# Altium project Project_HUMA-mini.PrjPcb
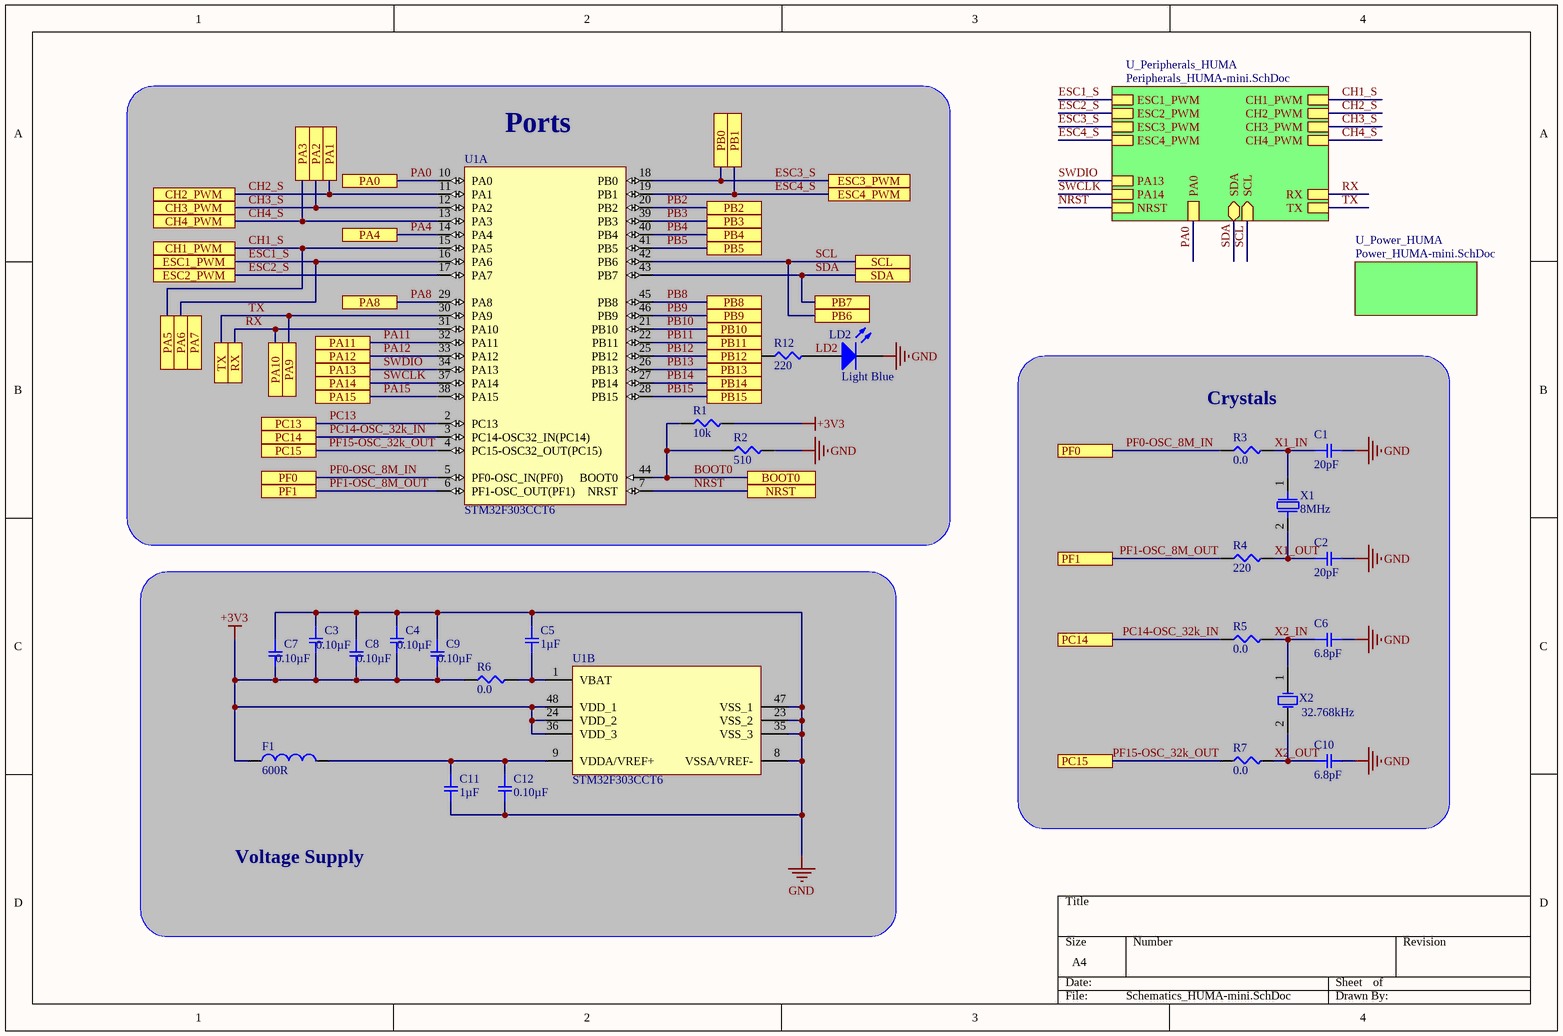
[diagram p0: Schematics_HUMA-mini.SchDoc]
3 sheets, 54 parts. Net scope: hierarchical (ports join the sheet entries above them; power ports are global).
Board file: PCB_HUMA-mini.PcbDoc
Sheets:
  Schematics_HUMA-mini.SchDoc
    U_Peripherals_HUMA = Peripherals_HUMA-mini.SchDoc
    U_Power_HUMA = Power_HUMA-mini.SchDoc

## Sheet Schematics_HUMA-mini.SchDoc
size A4

### Parts
C1  20pF  [SMD-0805C]
C2  20pF  [SMD-0805C]
C3  0.10µF  [SMD-0805C]
C4  0.10µF  [SMD-0805C]
C5  1µF  [SMD-0805C]
C6  6.8pF  [SMD-0805C]
C7  0.10µF  [SMD-0805C]
C8  0.10µF  [SMD-0805C]
C9  0.10µF  [SMD-0805C]
C10  6.8pF  [SMD-0805C]
C11  1µF  [SMD-0805C]
C12  0.10µF  [SMD-0805C]
F1  Deger: 600R  [IND_0805]  (hidden comment: FERRITE BEAD 600 OHM 1206 1LN)
LD2  Light Blue  [Type 3mm]
R1  10k  [SMD-0805-RES]
R2  510  [SMD-0805-RES]
R3  0.0  [SMD-0805-RES]
R4  220  [SMD-0805-RES]
R5  0.0  [SMD-0805-RES]
R6  0.0  [SMD-0805-RES]
R7  0.0  [SMD-0805-RES]
R12  220  [SMD-0805-RES]
U1  STM32F303CCT6  [STM-LQFP48_N]  (parts A,B of 2)
X1  8MHz  [OSC488W43P488L465H350Q2P]
X2  value 32.768kHz  [R38]  (hidden comment: XTAL)

### Blocks framed on the sheet
Ports: LD2 R1 R2 R12 U1
Crystals: C1 C2 C6 C10 R3-R5 R7 X1 X2
Voltage Supply: C3-C5 C7-C9 C11 C12 F1 R6 U1

### Sub-sheets
U_Peripherals_HUMA = Peripherals_HUMA-mini.SchDoc: ESC1_PWM, ESC2_PWM, ESC3_PWM, ESC4_PWM, SCL (in), SDA (bidir), PA13, PA14, NRST, CH4_PWM, RX, CH3_PWM, CH2_PWM, CH1_PWM, TX, PA0
U_Power_HUMA = Power_HUMA-mini.SchDoc: no entries

### Ports
BOOT0, CH1_PWM, CH2_PWM, CH3_PWM, CH4_PWM, ESC1_PWM, ESC2_PWM, ESC3_PWM, ESC4_PWM, NRST, PA0, PA1, PA2, PA3, PA4, PA5, PA6, PA7, PA8, PA9, PA10, PA11, PA12, PA13, PA14, PA15, PB0, PB1, PB2, PB3, PB4, PB5, PB6, PB7, PB8, PB9, PB10, PB11, PB12, PB13, PB14, PB15, PC13, PC14, PC15, PF0, PF1, RX, SCL, SDA, TX

### Nets
+3V3: C3.2 C4.2 C7.2 C8.2 C9.2 F1.1 R1.2 R6.1 U1.24(VDD_2) U1.36(VDD_3) U1.48(VDD_1)
GND: C1.2 C2.2 C3.1 C4.1 C5.1 C6.2 C7.1 C8.1 C9.1 C10.2 C11.2 C12.2 LD2.1(K) R2.2 U1.8(VSSA/VREF-) U1.23(VSS_2) U1.35(VSS_3) U1.47(VSS_1)
BOOT0: R1.1 R2.1 U1.44(BOOT0) ; port BOOT0
CH1_S: U1.15(PA5) ; port PA5, port CH1_PWM, sheet U_Peripherals_HUMA/CH1_PWM
CH2_S: U1.11(PA1) ; port PA1, port CH2_PWM, sheet U_Peripherals_HUMA/CH2_PWM
CH3_S: U1.12(PA2) ; port PA2, port CH3_PWM, sheet U_Peripherals_HUMA/CH3_PWM
CH4_S: U1.13(PA3) ; port PA3, port CH4_PWM, sheet U_Peripherals_HUMA/CH4_PWM
ESC1_S: U1.16(PA6) ; port PA6, port ESC1_PWM, sheet U_Peripherals_HUMA/ESC1_PWM
ESC2_S: U1.17(PA7) ; port ESC2_PWM, sheet U_Peripherals_HUMA/ESC2_PWM
ESC3_S: U1.18(PB0) ; port PB0, port ESC3_PWM, sheet U_Peripherals_HUMA/ESC3_PWM
ESC4_S: U1.19(PB1) ; port PB1, port ESC4_PWM, sheet U_Peripherals_HUMA/ESC4_PWM
LD2: LD2.2(A) R12.2
NRST: U1.7(NRST) ; port NRST, sheet U_Peripherals_HUMA/NRST
PA0: U1.10(PA0) ; port PA0, sheet U_Peripherals_HUMA/PA0
PA4: U1.14(PA4) ; port PA4
PA8: U1.29(PA8) ; port PA8
PA11: U1.32(PA11) ; port PA11
PA12: U1.33(PA12) ; port PA12
PA15: U1.38(PA15) ; port PA15
PB2: U1.20(PB2) ; port PB2
PB3: U1.39(PB3) ; port PB3
PB4: U1.40(PB4) ; port PB4
PB5: U1.41(PB5) ; port PB5
PB8: U1.45(PB8) ; port PB8
PB9: U1.46(PB9) ; port PB9
PB10: U1.21(PB10) ; port PB10
PB11: U1.22(PB11) ; port PB11
PB12: R12.1 U1.25(PB12) ; port PB12
PB13: U1.26(PB13) ; port PB13
PB14: U1.27(PB14) ; port PB14
PB15: U1.28(PB15) ; port PB15
PC13: U1.2(PC13) ; port PC13
PC14-OSC_32k_IN: R5.1 U1.3(PC14-OSC32_IN(PC14)) ; port PC14
PF0-OSC_8M_IN: R3.1 U1.5(PF0-OSC_IN(PF0)) ; port PF0
PF1-OSC_8M_OUT: R4.1 U1.6(PF1-OSC_OUT(PF1)) ; port PF1
PF15-OSC_32k_OUT: R7.1 U1.4(PC15-OSC32_OUT(PC15)) ; port PC15
RX: U1.31(PA10) ; port PA10, port RX, sheet U_Peripherals_HUMA/RX
SCL: U1.42(PB6) ; port PB6, port SCL, sheet U_Peripherals_HUMA/SCL
SDA: U1.43(PB7) ; port PB7, port SDA, sheet U_Peripherals_HUMA/SDA
SWCLK: U1.37(PA14) ; port PA14, sheet U_Peripherals_HUMA/PA14
SWDIO: U1.34(PA13) ; port PA13, sheet U_Peripherals_HUMA/PA13
TX: U1.30(PA9) ; port PA9, port TX, sheet U_Peripherals_HUMA/TX
X1_IN: C1.1 R3.2 X1.1
X1_OUT: C2.1 R4.2 X1.2
X2_IN: C6.1 R5.2 X2.1(OSC1)
X2_OUT: C10.1 R7.2 X2.2(OSC2)
NetC5_2: C5.2 R6.2 U1.1(VBAT)
NetC11_1: C11.1 C12.1 F1.2 U1.9(VDDA/VREF+)

### Library data of the parts
C1 C2 = GQM2195C1H200JB01D: CAP CER 20PF 50V NP0 0805; Manufacturer: Murata Electronics North America; Factory Stock: 0; Unit Price (USD): 0.78; Minimum Quantity: 1; Tolerance: ±5%; Temperature Coefficient: C0G, NP0; Datasheets: http://www.murata.com/~/media/webrenewal/support/library/catalog/products/capacitor/mlcc/c02e.pdf; Image: //media.digikey.com/Renders/Murata%20Renders/0805(GxM9).jpg; Digi-Key Part Number: 490-3607-1-ND; Part Number: GQM2195C1H200JB01D; Quantity Available: 270; @ qty: 0; Packaging: Cut Tape (CT); Series: GQM; Part Status: Active; Value: 20pF; Voltage: 50V; Operating Temperature: -55°C ~ 125°C; Features: High Q, Low Loss; Ratings: -; Applications: RF, Microwave, High Frequency; Mounting Type: Surface Mount, MLCC; Package / Case: 0805 (2012 Metric); Size / Dimension: 0.079" L x 0.049" W (2.00mm x 1.25mm); Height - Seated (Max): -; Thickness (Max): 0.037" (0.95mm); Lead Spacing: -; Lead Style: -
C3 C4 C7-C9 C12 = GRM219R71E104KA01D: CAP CER 0.1UF 25V X7R 0805; Manufacturer: Murata Electronics North America; Factory Stock: 0; Unit Price (USD): 0.12; Minimum Quantity: 1; Tolerance: ±10%; Datasheets: http://www.murata.com/~/media/webrenewal/support/library/catalog/products/capacitor/mlcc/c02e.pdf; Image: //media.digikey.com/Renders/Murata%20Renders/0805%20(2012%20Metric)%20.85mm.jpg; Digi-Key Part Number: 490-12754-1-ND; Part Number: GRM219R71E104KA01D; Quantity Available: 8594; @ qty: 0; Packaging: Cut Tape (CT); Series: GRM; Part Status: Active; Value: 0.10µF; Voltage: 25V; Temperature Coefficient: X7R; Operating Temperature: -55°C ~ 125°C; Features: -; Ratings: -; Applications: General Purpose; Mounting Type: Surface Mount, MLCC; Package / Case: 0805 (2012 Metric); Size / Dimension: 0.079" L x 0.049" W (2.00mm x 1.25mm); Height - Seated (Max): -; Thickness (Max): 0.037" (0.95mm); Lead Spacing: -; Lead Style: -
C5 C11 = GRT21BR61E105KE13L: CAP CER 1UF 25V X5R 0805; Manufacturer: Murata Electronics North America; Factory Stock: 0; Unit Price (USD): 0.2; Minimum Quantity: 1; Tolerance: ±10%; Datasheets: http://search.murata.co.jp/Ceramy/image/img/A01X/G101/ENG/GRT21BR61E105KE13-01.pdf; Image: //media.digikey.com/Renders/Murata%20Renders/GRT%20Series%200805(2012%20Metric).jpg; Digi-Key Part Number: 490-12386-1-ND; Part Number: GRT21BR61E105KE13L; Quantity Available: 2725; @ qty: 0; Packaging: Cut Tape (CT); Series: GRT; Part Status: Active; Value: 1µF; Voltage: 25V; Temperature Coefficient: X5R; Operating Temperature: -55°C ~ 85°C; Features: -; Ratings: AEC-Q200; Applications: Automotive; Mounting Type: Surface Mount, MLCC; Package / Case: 0805 (2012 Metric); Size / Dimension: 0.079" L x 0.049" W (2.00mm x 1.25mm); Height - Seated (Max): -; Thickness (Max): 0.057" (1.45mm); Lead Spacing: -; Lead Style: -
C6 C10 = GQM2195C2A6R8DB01D: CAP CER 6.8PF 100V NP0 0805; Manufacturer: Murata Electronics North America; Factory Stock: 0; Unit Price (USD): 0.71; Minimum Quantity: 1; Tolerance: ±0.5pF; Temperature Coefficient: C0G, NP0; Datasheets: http://www.murata.com/~/media/webrenewal/support/library/catalog/products/capacitor/mlcc/c02e.pdf; Image: //media.digikey.com/Renders/Murata%20Renders/0805(GxM9).jpg; Digi-Key Part Number: 490-8142-1-ND; Part Number: GQM2195C2A6R8DB01D; Quantity Available: 3756; @ qty: 0; Packaging: Cut Tape (CT); Series: GQM; Part Status: Active; Value: 6.8pF; Voltage: 100V; Operating Temperature: -55°C ~ 125°C; Features: High Q, Low Loss; Ratings: -; Applications: RF, Microwave, High Frequency; Mounting Type: Surface Mount, MLCC; Package / Case: 0805 (2012 Metric); Size / Dimension: 0.079" L x 0.049" W (2.00mm x 1.25mm); Height - Seated (Max): -; Thickness (Max): 0.037" (0.95mm); Lead Spacing: -; Lead Style: -
F1 = Ferrite 600ohm 1206(742792118): 600 Ohms @ 100MHz 1 Signal Line Ferrite Bead 1206 (3216 Metric) 2.5A 70mOhm; Kılıf: 1206; -Sicaklik: -55; +Sicaklik: +125; Nero Kodu: NE-S-02777; Yıkama Bilgisi: UYGUN; Epoksi Bilgisi: YOK; Lehim Yöntemi: SMD; Cins: Ferrite; Uretici Kodu: 742792118; Kaplama Bilgisi: UYGUN; MSL: 1 (Unlimited)
LD2 = 151033BS03000: THT LED round mono-color waterclear, WL-TMRW , Blue; PackageReference: Type 3mm; Emitting color: Blue; PartNumber: 151033BS03000; ComponentLink1Description: Manufacturer URL; ComponentLink1URL: http://www.we-online.com; ComponentLink2Description: Datasheet; ComponentLink2URL: http://katalog.we-online.de/pbs/datasheet/7448042001.pdfhttp://katalog.we-online.de/pbs/datasheet/7448042001.pdfhttp://katalog.we-online.de/pbs/datasheet/7448042001.pdfhttp://katalog.we-online.de/pbs/datasheet/151033BS03000.pdf
R1 = ERJ-6ENF1002V: RES SMD 10K OHM 1% 1/8W 0805; Manufacturer: Panasonic Electronic Components; Factory Stock: 0; Unit Price (USD): 0.00729; @ qty: 1500; Minimum Quantity: 1; Power (Watts): 0.125W, 1/8W; Temperature Coefficient: ±100ppm/°C; Part Number: ERJ-6ENF1002V; Datasheets: http://industrial.panasonic.com/www-cgi/jvcr13pz.cgi?E+PZ+3+AOA0002+ERJ6ENF1002V+7+WW; Image: //media.digikey.com/Renders/Panasonic%20Renders/ERJ-0805%20Pkg.jpg; Digi-Key Part Number: P10.0KCCT-ND; Quantity Available: 3985614; Packaging: Cut Tape (CT); Series: ERJ; Part Status: Active; Value: 10k; Tolerance: ±1%; Composition: Thick Film; Features: Automotive AEC-Q200; Operating Temperature: -55°C ~ 155°C; Package / Case: 0805 (2012 Metric); Supplier Device Package: 0805; Size / Dimension: 0.079" L x 0.049" W (2.00mm x 1.25mm); Height - Seated (Max): 0.028" (0.70mm); Number of Terminations: 2; Failure Rate: -
R2 = ERJ-P06J511V: RES SMD 510 OHM 5% 1/2W 0805; Manufacturer: Panasonic Electronic Components; Factory Stock: 0; Unit Price (USD): 0.01839; @ qty: 1500; Minimum Quantity: 1; Power (Watts): 0.5W, 1/2W; Temperature Coefficient: ±200ppm/°C; Part Number: ERJ-P06J511V; Datasheets: https://industrial.panasonic.com/cdbs/www-data/pdf/RDA0000/AOA0000C243.pdf; Image: //media.digikey.com/Renders/Panasonic%20Renders/ERJ-0805%20Pkg.jpg; Digi-Key Part Number: P510ADCT-ND; Quantity Available: 54515; Packaging: Cut Tape (CT); Series: ERJ; Part Status: Active; Value: 510; Tolerance: ±5%; Composition: Thick Film; Features: Automotive AEC-Q200, Pulse Withstanding; Operating Temperature: -55°C ~ 155°C; Package / Case: 0805 (2012 Metric); Supplier Device Package: 0805; Size / Dimension: 0.079" L x 0.049" W (2.00mm x 1.25mm); Height - Seated (Max): 0.028" (0.70mm); Number of Terminations: 2; Failure Rate: -
R3 R5-R7 = ERJ-6GEY0R00V: RES SMD 0.0 OHM JUMPER 1/8W 0805; Manufacturer: Panasonic Electronic Components; Factory Stock: 0; Unit Price (USD): 0.00544; @ qty: 1500; Minimum Quantity: 1; Power (Watts): 0.125W, 1/8W; Part Number: ERJ-6GEY0R00V; Datasheets: http://industrial.panasonic.com/www-cgi/jvcr13pz.cgi?E+PZ+3+AOA0001+ERJ6GEY0R00V+7+WW; Image: //media.digikey.com/Renders/Panasonic%20Renders/ERJ-0805%20Pkg.jpg; Digi-Key Part Number: P0.0ACT-ND; Quantity Available: 1597627; Packaging: Cut Tape (CT); Series: ERJ; Part Status: Active; Value: 0.0; Tolerance: Jumper; Composition: Thick Film; Features: Automotive AEC-Q200; Temperature Coefficient: -; Operating Temperature: -55°C ~ 155°C; Package / Case: 0805 (2012 Metric); Supplier Device Package: 0805; Size / Dimension: 0.079" L x 0.049" W (2.00mm x 1.25mm); Height - Seated (Max): 0.028" (0.70mm); Number of Terminations: 2; Failure Rate: -
R4 = ERJ-6ENF2200V: RES SMD 220 OHM 1% 1/8W 0805; Manufacturer: Panasonic Electronic Components; Factory Stock: 0; Unit Price (USD): 0.00729; @ qty: 1500; Minimum Quantity: 1; Power (Watts): 0.125W, 1/8W; Temperature Coefficient: ±100ppm/°C; Part Number: ERJ-6ENF2200V; Datasheets: http://industrial.panasonic.com/www-cgi/jvcr13pz.cgi?E+PZ+3+AOA0002+ERJ6ENF2200V+7+WW; Image: //media.digikey.com/Renders/Panasonic%20Renders/ERJ-0805%20Pkg.jpg; Digi-Key Part Number: P220CCT-ND; Quantity Available: 111570; Packaging: Cut Tape (CT); Series: ERJ; Part Status: Active; Value: 220; Tolerance: ±1%; Composition: Thick Film; Features: Automotive AEC-Q200; Operating Temperature: -55°C ~ 155°C; Package / Case: 0805 (2012 Metric); Supplier Device Package: 0805; Size / Dimension: 0.079" L x 0.049" W (2.00mm x 1.25mm); Height - Seated (Max): 0.028" (0.70mm); Number of Terminations: 2; Failure Rate: -
R12 = ERJ-P6WJ221V: RES SMD 220 OHM 5% 1/2W 0805; Manufacturer: Panasonic Electronic Components; Factory Stock: 0; Unit Price (USD): 0.08237; @ qty: 1500; Minimum Quantity: 1; Power (Watts): 0.5W, 1/2W; Temperature Coefficient: ±200ppm/°C; Part Number: ERJ-P6WJ221V; Datasheets: https://industrial.panasonic.com/cdbs/www-data/pdf/RDA0000/AOA0000C243.pdf; Image: //media.digikey.com/Renders/Panasonic%20Renders/ERJ-0805%20Pkg.jpg; Digi-Key Part Number: P16946CT-ND; Quantity Available: 4990; Packaging: Cut Tape (CT); Series: ERJ; Part Status: Active; Value: 220; Tolerance: ±5%; Composition: Thick Film; Features: Automotive AEC-Q200, Pulse Withstanding; Operating Temperature: -55°C ~ 155°C; Package / Case: 0805 (2012 Metric); Supplier Device Package: 0805; Size / Dimension: 0.079" L x 0.049" W (2.00mm x 1.25mm); Height - Seated (Max): 0.030" (0.75mm); Number of Terminations: 2; Failure Rate: -
U1 = STM32F303CCT6: ARM Cortex-M4 32-bit MCU, 256 KB Flash, 40 KB Internal RAM, 37 I/Os, 48-pin LQFP, -40 to 85 degC, Tray; D/A Converter: 2x12-bit (2 Channel); FLASH Size (Prog) (kB): 256; I/Os (High Current): 37; Internal RAM Size (kB): 40; Operating Frequency(F) (Processor speed) (MHz): 72; Supply Voltage(Vcc) min (V): 2; DatasheetVersion: Rev. 6; PackageVersion: Rev. 6, 06/2013; PackageReference: LQFP48; PackageDescription: 48-Pin Low Profile Quad Flat Package, 7 x 7 mm Body, 0.5 mm Pitch; Supplier 1: Digi-Key; Supplier Part Number 1: 497-13318-ND; Supplier 2: Newark; Supplier Part Number 2: 46W2192; Supplier 3: Newark; Supplier Part Number 3: 66W7286; Supplier 4: Mouser; Supplier Part Number 4: 511-STM32F303CCT6; Core: ARM Cortex-M4; Packing: Tray; Mounting Technology: Surface Mount; PartNumber: STM32F303CCT6; ComponentLink1Description: Manufacturer URL; ComponentLink1URL: http://www.st.com/web/en/home.html; ComponentLink2Description: Datasheet; ComponentLink2URL: http://www.st.com/st-web-ui/static/active/en/resource/technical/document/datasheet/DM00058181.pdf; ComponentLink3Description: Package Specification; ComponentLink3URL: http://www.st.com/st-web-ui/static/active/en/resource/technical/document/datasheet/DM00058181.pdf
X1 = XTAL8MHz: Crystal; Frequency: 8MHz; Frequency; MP: X14M745600L225; MF: AEL Crystals; SnapEDA_Link: https://www.snapeda.com/parts/X14M745600L225/AEL%20Crystals/view-part/380339/?ref=snap; Price: None; Value: *; Availability: Unavailable; Package: None
X2 = XTAL: Crystal Oscillator; Published: 8-Jun-2000; LatestRevisionDate: 17-Jul-2002; LatestRevisionNote: Re-released for DXP Platform.; PackageReference: R38; Publisher: Altium Limited; PackageDescription: Crystal, Thru-Hole; 2 Leads; Body 3.1 x 8.2 mm (Dia.xH)

## Sheet Peripherals_HUMA-mini.SchDoc
size A4
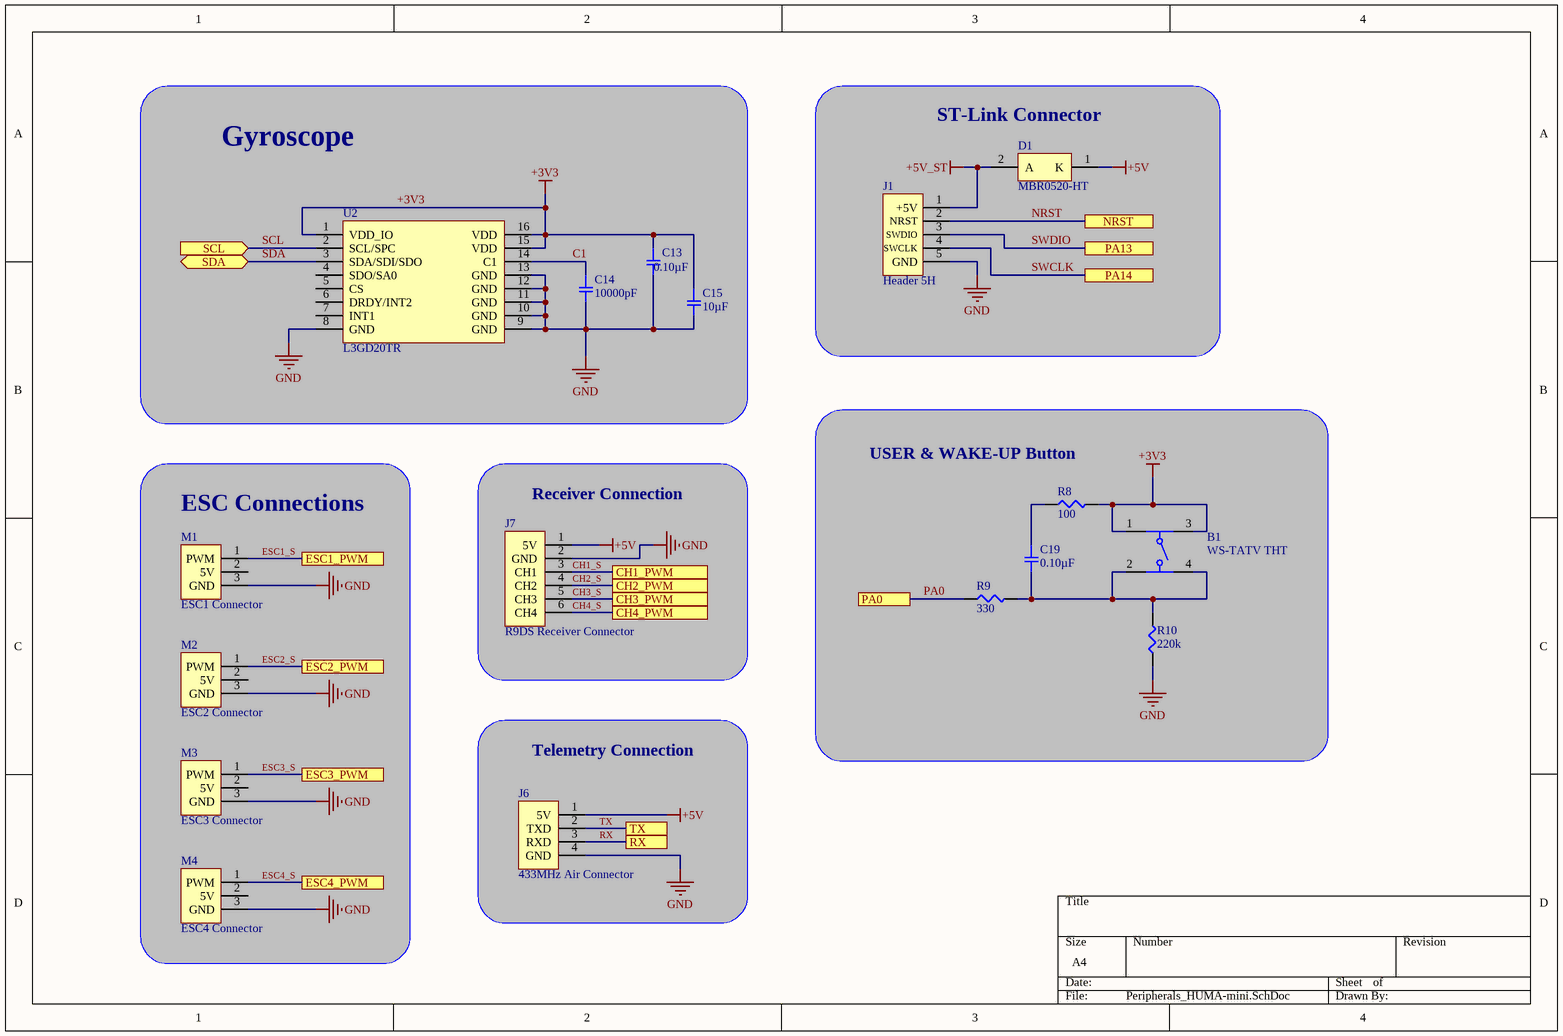
[diagram p1: Peripherals_HUMA-mini.SchDoc]

### Parts
B1  WS-TATV THT  [4301x60507x6]
C13  0.10µF  [SMD-0805C]
C14  10000pF  [SMD-0805C]
C15  10µF  [SMD-0805C]
C19  0.10µF  [SMD-0805C]
D1  MBR0520-HT  [ONSC-SOD-123-2-425-04_V]
J1  Header 5H  [HDR1X5H]
J6  433MHz Air Connector  [HDR1X4H]
J7  R9DS Receiver Connector  [HDR1X6H]
M1  ESC1 Connector  [HDR1X3H]
M2  ESC2 Connector  [HDR1X3H]
M3  ESC3 Connector  [HDR1X3H]
M4  ESC4 Connector  [HDR1X3H]
R8  100  [SMD-0805-RES]
R9  330  [SMD-0805-RES]
R10  220k  [SMD-0805-RES]
U2  L3GD20TR  [LGA16C65P6X6_400X400X100]  (value not drawn)

### Blocks framed on the sheet
Gyroscope: C13-C15 U2
ST-Link Connector: D1 J1
USER & WAKE-UP Button: B1 C19 R8-R10
ESC Connections: M1-M4
Receiver Connection: J7
Telemetry Connection: J6

### Ports
CH1_PWM, CH2_PWM, CH3_PWM, CH4_PWM, ESC1_PWM, ESC2_PWM, ESC3_PWM, ESC4_PWM, NRST, PA0, PA13, PA14, RX, SCL (in), SDA (bidir), TX

### Nets
+3V3: B1.1 B1.3 C13.1 C15.1 R8.2 U2.1(VDD_IO) U2.15(VDD) U2.16(VDD)
+5V: D1.1(K) J6.1(5V) J7.1(5V)
+5V_ST: D1.2(A) J1.1(+5V)
GND: C13.2 C14.2 C15.2 J1.5(GND) J6.4(GND) J7.2(GND) M1.3(GND) M2.3(GND) M3.3(GND) M4.3(GND) R10.1 U2.8(GND) U2.9(GND) U2.10(GND) U2.11(GND) U2.12(GND) U2.13(GND)
C1: C14.1 U2.14(C1)
CH1_S: J7.3(CH1) ; port CH1_PWM
CH2_S: J7.4(CH2) ; port CH2_PWM
CH3_S: J7.5(CH3) ; port CH3_PWM
CH4_S: J7.6(CH4) ; port CH4_PWM
ESC1_S: M1.1(PWM) ; port ESC1_PWM
ESC2_S: M2.1(PWM) ; port ESC2_PWM
ESC3_S: M3.1(PWM) ; port ESC3_PWM
ESC4_S: M4.1(PWM) ; port ESC4_PWM
NRST: J1.2(NRST) ; port NRST
PA0: R9.1 ; port PA0
RX: J6.3(RXD) ; port RX
SCL: U2.2(SCL/SPC) ; port SCL
SDA: U2.3(SDA/SDI/SDO) ; port SDA
SWCLK: J1.4(SWCLK) ; port PA14
SWDIO: J1.3(SWDIO) ; port PA13
TX: J6.2(TXD) ; port TX
NetB1_2: B1.2 B1.4 C19.2 R9.2 R10.2
NetC19_1: C19.1 R8.1

Not connected (* = marked no-connect by the designer): M1 2(5V); M2 2(5V); M3 2(5V); M4 2(5V); U2 4(SDO/SA0) 5(CS) 6(DRDY/INT2) 7(INT1)

### Library data of the parts
B1 = 430156050726: WS-TATV THT Tact Switch 6x6mm, height 5mm, 260gf; Rated Voltage: 12VDC; Rated Current: 50mA; Washable: No; ComponentLink1Description: Manufacturer; ComponentLink1URL: http://www.we-online.de; ComponentLink2Description: Datasheet; ComponentLink2URL: https://katalog.we-online.com/em/datasheet/430156050726.pdf; Operating Temperature: -40 to +85degC; Part Number: 430156050726; Published Date: September 2019; Contact Material: Stainless Steel; Height: 5mm; Mounting Technology: THT; Contact Plating: Silver; Operation Force: 260gf; Packaging: Bulk; Terminal Material: Copper Alloy; Publisher: Wurth Elektronik; Terminal Plating: Silver
C13 = GRM219R71E104KA01D: as C3 on sheet Schematics_HUMA-mini; Datasheets: http://www.murata.com/~/media/webrenewal/support/library/catalog/products/capacitor/mlcc/c02e.pdf; Image: //media.digikey.com/Renders/Murata%20Renders/0805%20(2012%20Metric)%20.85mm.jpg; Digi-Key Part Number: 490-12754-1-ND; Part Number: GRM219R71E104KA01D; Quantity Available: 8594; @ qty: 0; Packaging: Cut Tape (CT); Series: GRM; Part Status: Active; Value: 0.10µF; Voltage: 25V; Temperature Coefficient: X7R; Operating Temperature: -55°C ~ 125°C; Features: -; Ratings: -; Applications: General Purpose; Mounting Type: Surface Mount, MLCC; Package / Case: 0805 (2012 Metric); Size / Dimension: 0.079" L x 0.049" W (2.00mm x 1.25mm); Height - Seated (Max): -; Thickness (Max): 0.037" (0.95mm); Lead Spacing: -; Lead Style: -
C14 = LLA215R71E103MA14L: CAP CER 10000PF 25V X7R 0805; Manufacturer: Murata Electronics North America; Factory Stock: 0; Unit Price (USD): 0.33; Minimum Quantity: 1; Tolerance: ±20%; Datasheets: http://www.murata.com/~/media/webrenewal/support/library/catalog/products/capacitor/mlcc/c02e.pdf; Image: //media.digikey.com/Renders/Murata%20Renders/0805-LLA.jpg; Digi-Key Part Number: 490-4424-1-ND; Part Number: LLA215R71E103MA14L; Quantity Available: 28252; @ qty: 0; Packaging: Cut Tape (CT); Series: LLA; Part Status: Active; Value: 10000pF; Voltage: 25V; Temperature Coefficient: X7R; Operating Temperature: -55°C ~ 125°C; Features: Low ESL (Multi-Terminal); Ratings: -; Applications: Bypass, Decoupling; Mounting Type: Surface Mount, MLCC; Package / Case: 0805 (2012 Metric); Size / Dimension: 0.079" L x 0.049" W (2.00mm x 1.25mm); Height - Seated (Max): -; Thickness (Max): 0.022" (0.55mm); Lead Spacing: -; Lead Style: -
C15 = GRM21BC81C106KA73L: CAP CER 10UF 16V X6S 0805; Manufacturer: Murata Electronics North America; Factory Stock: 0; Unit Price (USD): 0.2; Minimum Quantity: 1; Tolerance: ±10%; Datasheets: http://www.murata.com/~/media/webrenewal/support/library/catalog/products/capacitor/mlcc/c02e.pdf; Image: //media.digikey.com/Renders/Murata%20Renders/0805%20(2012%20Metric)%20.85mm.jpg; Digi-Key Part Number: 490-5519-1-ND; Part Number: GRM21BC81C106KA73L; Quantity Available: 118069; @ qty: 0; Packaging: Cut Tape (CT); Series: GRM; Part Status: Active; Value: 10µF; Voltage: 16V; Temperature Coefficient: X6S; Operating Temperature: -55°C ~ 105°C; Features: -; Ratings: -; Applications: General Purpose; Mounting Type: Surface Mount, MLCC; Package / Case: 0805 (2012 Metric); Size / Dimension: 0.079" L x 0.049" W (2.00mm x 1.25mm); Height - Seated (Max): -; Thickness (Max): 0.053" (1.35mm); Lead Spacing: -; Lead Style: -
C19 = GRM21B7U1A104JA01L: CAP CER 0.1UF 10V U2J 0805; Manufacturer: Murata Electronics North America; Factory Stock: 0; Unit Price (USD): 0.4; Minimum Quantity: 1; Tolerance: ±5%; Datasheets: http://www.murata.com/~/media/webrenewal/support/library/catalog/products/capacitor/mlcc/c02e.pdf; Image: //media.digikey.com/Renders/Murata%20Renders/0805%20(2012%20Metric)%20.85mm.jpg; Digi-Key Part Number: 490-11592-1-ND; Part Number: GRM21B7U1A104JA01L; Quantity Available: 3390; @ qty: 0; Packaging: Cut Tape (CT); Series: GRM; Part Status: Active; Value: 0.10µF; Voltage: 10V; Temperature Coefficient: U2J; Operating Temperature: -55°C ~ 125°C; Features: -; Ratings: -; Applications: General Purpose; Mounting Type: Surface Mount, MLCC; Package / Case: 0805 (2012 Metric); Size / Dimension: 0.079" L x 0.049" W (2.00mm x 1.25mm); Height - Seated (Max): -; Thickness (Max): 0.053" (1.35mm); Lead Spacing: -; Lead Style: -
D1 = MBR0520LT1: 20V 0.5A Schottky Power Rectifier, 2-Pin SOD-123, Tape and Reel; Manufacturer: On Semiconductor; Configuration: Single; IFSM Max (A): 5.5; DatasheetVersion: Rev. 6; PackageVersion: Rev. G, 10/2009; PackageReference: SOD-123-2-425-04; PackageDescription: 2-Pin SOD, Body 1.6 x 2.69 mm; Supplier 1: Digi-Key; Supplier Part Number 1: MBR0520LT1OSCT-ND; Packing: Tape and Reel; RoHS: FALSE; Mounting Technology: Surface Mount; PartNumber: MBR0520LT1; ComponentLink1Description: Manufacturer URL; ComponentLink1URL: http://www.onsemi.com/; ComponentLink2Description: Datasheet; ComponentLink2URL: http://www.onsemi.cn/pub_link/Collateral/MBR0520LT1-D.PDF; ComponentLink3Description: Package Specification; ComponentLink3URL: http://www.onsemi.com/pub_link/Collateral/425-04.PDF
J1 = Header 5H: Header, 5-Pin, Right Angle; LatestRevisionDate: 17-Jul-2002; LatestRevisionNote: Re-released for DXP Platform.; Publisher: Altium Limited
J6 = Header 4H: Header, 4-Pin, Right Angle; LatestRevisionDate: 17-Jul-2002; LatestRevisionNote: Re-released for DXP Platform.; Publisher: Altium Limited
J7 = Header 6H: Header, 6-Pin, Right Angle; LatestRevisionDate: 17-Jul-2002; LatestRevisionNote: Re-released for DXP Platform.; Publisher: Altium Limited
M1-M4 = Header 3H: Header, 3-Pin, Right Angle; LatestRevisionDate: 17-Jul-2002; LatestRevisionNote: Re-released for DXP Platform.; Publisher: Altium Limited
R8 = ERJ-P06J101V: RES SMD 100 OHM 5% 1/2W 0805; Manufacturer: Panasonic Electronic Components; Factory Stock: 0; Unit Price (USD): 0.01839; @ qty: 1500; Minimum Quantity: 1; Power (Watts): 0.5W, 1/2W; Temperature Coefficient: ±200ppm/°C; Part Number: ERJ-P06J101V; Datasheets: https://industrial.panasonic.com/cdbs/www-data/pdf/RDA0000/AOA0000C243.pdf; Image: //media.digikey.com/Renders/Panasonic%20Renders/ERJ-0805%20Pkg.jpg; Digi-Key Part Number: P100ADCT-ND; Quantity Available: 127985; Packaging: Cut Tape (CT); Series: ERJ; Part Status: Active; Value: 100; Tolerance: ±5%; Composition: Thick Film; Features: Automotive AEC-Q200, Pulse Withstanding; Operating Temperature: -55°C ~ 155°C; Package / Case: 0805 (2012 Metric); Supplier Device Package: 0805; Size / Dimension: 0.079" L x 0.049" W (2.00mm x 1.25mm); Height - Seated (Max): 0.028" (0.70mm); Number of Terminations: 2; Failure Rate: -
R9 = ERJ-P6WJ331V: RES SMD 330 OHM 5% 1/2W 0805; Manufacturer: Panasonic Electronic Components; Factory Stock: 0; Unit Price (USD): 0.08237; @ qty: 1500; Minimum Quantity: 1; Power (Watts): 0.5W, 1/2W; Temperature Coefficient: ±200ppm/°C; Part Number: ERJ-P6WJ331V; Datasheets: https://industrial.panasonic.com/cdbs/www-data/pdf/RDA0000/AOA0000C243.pdf; Image: //media.digikey.com/Renders/Panasonic%20Renders/ERJ-0805%20Pkg.jpg; Digi-Key Part Number: P16948CT-ND; Quantity Available: 4857; Packaging: Cut Tape (CT); Series: ERJ; Part Status: Active; Value: 330; Tolerance: ±5%; Composition: Thick Film; Features: Automotive AEC-Q200, Pulse Withstanding; Operating Temperature: -55°C ~ 155°C; Package / Case: 0805 (2012 Metric); Supplier Device Package: 0805; Size / Dimension: 0.079" L x 0.049" W (2.00mm x 1.25mm); Height - Seated (Max): 0.030" (0.75mm); Number of Terminations: 2; Failure Rate: -
R10 = ERJ-P06J224V: RES SMD 220K OHM 5% 1/2W 0805; Manufacturer: Panasonic Electronic Components; Factory Stock: 0; Unit Price (USD): 0.01839; @ qty: 1500; Minimum Quantity: 1; Power (Watts): 0.5W, 1/2W; Temperature Coefficient: ±200ppm/°C; Part Number: ERJ-P06J224V; Datasheets: https://industrial.panasonic.com/cdbs/www-data/pdf/RDA0000/AOA0000C243.pdf; Image: //media.digikey.com/Renders/Panasonic%20Renders/ERJ-0805%20Pkg.jpg; Digi-Key Part Number: P220KADCT-ND; Quantity Available: 20074; Packaging: Cut Tape (CT); Series: ERJ; Part Status: Active; Value: 220k; Tolerance: ±5%; Composition: Thick Film; Features: Automotive AEC-Q200, Pulse Withstanding; Operating Temperature: -55°C ~ 155°C; Package / Case: 0805 (2012 Metric); Supplier Device Package: 0805; Size / Dimension: 0.079" L x 0.049" W (2.00mm x 1.25mm); Height - Seated (Max): 0.028" (0.70mm); Number of Terminations: 2; Failure Rate: -
U2 = L3GD20TR: Gyroscope X (Pitch), Y (Roll), Z (Yaw) ±250, 500, 2000 47.5Hz ~ 380Hz I²C, SPI 16-LGA (4x4); PartName: L3GD20TR

## Sheet Power_HUMA-mini.SchDoc
size A4
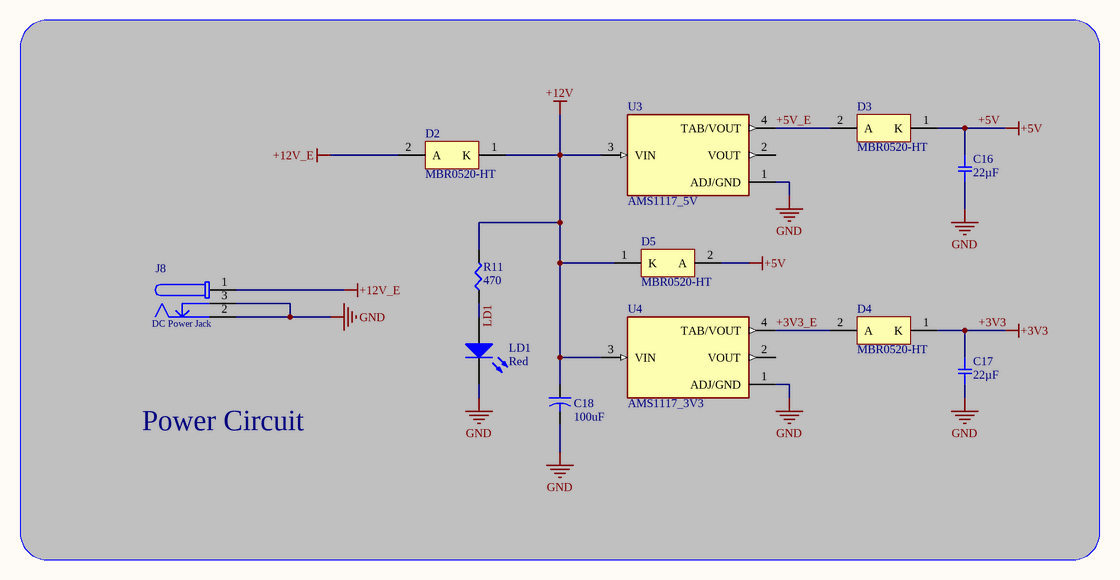
[diagram p2: Power_HUMA-mini.SchDoc]

### Parts
C16  22µF  [SMD-1206C]
C17  22µF  [SMD-1206C]
C18  value 100uF  [CAPR5-4X5]  (hidden comment: Cap2)
D2  MBR0520-HT  [ONSC-SOD-123-2-425-04_V]
D3  MBR0520-HT  [ONSC-SOD-123-2-425-04_V]
D4  MBR0520-HT  [ONSC-SOD-123-2-425-04_V]
D5  MBR0520-HT  [ONSC-SOD-123-2-425-04_V]
J8  DC Power Jack  [694106301002]
LD1  Red  [Type 3mm]
R11  470  [SMD-0805-RES]
U3  AMS1117_5V  [*SOT229P700X180-4N]
U4  AMS1117_3V3  [*SOT229P700X180-4N]

### Blocks framed on the sheet
Power Circuit: C16-C18 D2-D5 J8 LD1 R11 U3 U4

### Nets
+3V3: C17.1 D4.1(K)
+5V: C16.1 D3.1(K) D5.2(A)
+12V: C18.1 D2.1(K) D5.1(K) R11.2 U3.3(VIN) U4.3(VIN)
+12V_E: D2.2(A) J8.1
GND: C16.2 C17.2 C18.2 J8.2 J8.3 LD1.1(K) U3.1(ADJ/GND) U4.1(ADJ/GND)
+3V3_E: D4.2(A) U4.4(TAB/VOUT)
+5V_E: D3.2(A) U3.4(TAB/VOUT)
LD1: LD1.2(A) R11.1

Not connected (* = marked no-connect by the designer): U3 2(VOUT); U4 2(VOUT)

### Library data of the parts
C16 C17 = GRM31CR71A226ME15L: CAP CER 22UF 10V X7R 1206; Manufacturer: Murata Electronics North America; Factory Stock: 0; Unit Price (USD): 0.51; Minimum Quantity: 1; Tolerance: ±20%; Datasheets: http://www.murata.com/~/media/webrenewal/support/library/catalog/products/capacitor/mlcc/c02e.pdf; Image: //media.digikey.com/Renders/Murata%20Renders/GR331BD72E473KW01L.jpg; Digi-Key Part Number: 490-6516-1-ND; Part Number: GRM31CR71A226ME15L; Quantity Available: 107; @ qty: 0; Packaging: Cut Tape (CT); Series: GRM; Part Status: Active; Value: 22µF; Voltage: 10V; Temperature Coefficient: X7R; Operating Temperature: -55°C ~ 125°C; Features: -; Ratings: -; Applications: General Purpose; Mounting Type: Surface Mount, MLCC; Package / Case: 1206 (3216 Metric); Size / Dimension: 0.126" L x 0.063" W (3.20mm x 1.60mm); Height - Seated (Max): -; Thickness (Max): 0.071" (1.80mm); Lead Spacing: -; Lead Style: -
C18 = Cap2: Capacitor; Published: 23-Sep-2002; PackageReference: CAPR5-4X5; Publisher: Altium Limited; PackageDescription: Capacitor; 2 Leads
D2-D5 = MBR0520LT1: as D1 on sheet Peripherals_HUMA-mini; DatasheetVersion: Rev. 6; PackageVersion: Rev. G, 10/2009; PackageReference: SOD-123-2-425-04; PackageDescription: 2-Pin SOD, Body 1.6 x 2.69 mm; Supplier 1: Digi-Key; Supplier Part Number 1: MBR0520LT1OSCT-ND; Packing: Tape and Reel; RoHS: FALSE; Mounting Technology: Surface Mount; PartNumber: MBR0520LT1; ComponentLink1Description: Manufacturer URL; ComponentLink1URL: http://www.onsemi.com/; ComponentLink2Description: Datasheet; ComponentLink2URL: http://www.onsemi.cn/pub_link/Collateral/MBR0520LT1-D.PDF; ComponentLink3Description: Package Specification; ComponentLink3URL: http://www.onsemi.com/pub_link/Collateral/425-04.PDF
J8 = 694106301002: DC Power Jack Connector WR-DC, Male, Right Angled, THT, 5 A, 24 V; Opening Diameter: 6.4 mm; Plug Inner Diameter: 2.05 mm; Plug Outer Diameter: 5.5 mm; Rated Current: 5 A; Working Voltage: 24 V; ComponentLink1Description: Manufacturer; ComponentLink1URL: http://www.we-online.de; ComponentLink2Description: Datasheet; ComponentLink2URL: http://katalog.we-online.de/em/datasheet/6941xx301002.pdf; Part Number: 694106301002; Published Date: August 2018; Publisher: Wurth Elektronik; Orientation: Right Angled; Operating Temperature: -40 to 85 degC; Mounting Technology: THT; Gender: Male; Packaging: Bag
LD1 = 151033RS03000: THT LED round mono-color waterclear, WL-TMRW, Red; PackageReference: Type 3mm; Emitting color: Red; PartNumber: 151033RS03000; ComponentLink1Description: Manufacturer URL; ComponentLink1URL: http://www.we-online.com; ComponentLink2Description: Datasheet; ComponentLink2URL: http://katalog.we-online.de/pbs/datasheet/7448042001.pdfhttp://katalog.we-online.de/pbs/datasheet/7448042001.pdfhttp://katalog.we-online.de/pbs/datasheet/7448042001.pdfhttp://katalog.we-online.de/pbs/datasheet/151033RS03000.pdf
R11 = ERJ-P6WJ471V: RES SMD 470 OHM 5% 1/2W 0805; Manufacturer: Panasonic Electronic Components; Factory Stock: 0; Unit Price (USD): 0.08237; @ qty: 1500; Minimum Quantity: 1; Power (Watts): 0.5W, 1/2W; Temperature Coefficient: ±200ppm/°C; Part Number: ERJ-P6WJ471V; Datasheets: https://industrial.panasonic.com/cdbs/www-data/pdf/RDA0000/AOA0000C243.pdf; Image: //media.digikey.com/Renders/Panasonic%20Renders/ERJ-0805%20Pkg.jpg; Digi-Key Part Number: P16950CT-ND; Quantity Available: 4195; Packaging: Cut Tape (CT); Series: ERJ; Part Status: Active; Value: 470; Tolerance: ±5%; Composition: Thick Film; Features: Automotive AEC-Q200, Pulse Withstanding; Operating Temperature: -55°C ~ 155°C; Package / Case: 0805 (2012 Metric); Supplier Device Package: 0805; Size / Dimension: 0.079" L x 0.049" W (2.00mm x 1.25mm); Height - Seated (Max): 0.030" (0.75mm); Number of Terminations: 2; Failure Rate: -
U3 U4 = AMS1117: Sot223/Pkg 1-Amp Low Drop Out Voltage Regulator; MF: Advanced Monolithic Systems; MP: AMS1117-3.3; Package: None; Price: None; Availability: Unavailable; SnapEDA_Link: https://www.snapeda.com/parts/AMS1117-3.3/Advanced%20Monolithic%20Systems/view-part/53450/?ref=snap; Value: *

## Nets that join several sheets
+3V3: Schematics_HUMA-mini (11 pins), Peripherals_HUMA-mini (8 pins), Power_HUMA-mini (C17.1 D4.1)
+5V: Peripherals_HUMA-mini (D1.1 J6.1 J7.1), Power_HUMA-mini (C16.1 D3.1 D5.2)
GND: Schematics_HUMA-mini (18 pins), Peripherals_HUMA-mini (17 pins), Power_HUMA-mini (8 pins)
CH1_S: Schematics_HUMA-mini (U1.15), Peripherals_HUMA-mini (J7.3)
CH2_S: Schematics_HUMA-mini (U1.11), Peripherals_HUMA-mini (J7.4)
CH3_S: Schematics_HUMA-mini (U1.12), Peripherals_HUMA-mini (J7.5)
CH4_S: Schematics_HUMA-mini (U1.13), Peripherals_HUMA-mini (J7.6)
ESC1_S: Schematics_HUMA-mini (U1.16), Peripherals_HUMA-mini (M1.1)
ESC2_S: Schematics_HUMA-mini (U1.17), Peripherals_HUMA-mini (M2.1)
ESC3_S: Schematics_HUMA-mini (U1.18), Peripherals_HUMA-mini (M3.1)
ESC4_S: Schematics_HUMA-mini (U1.19), Peripherals_HUMA-mini (M4.1)
NRST: Schematics_HUMA-mini (U1.7), Peripherals_HUMA-mini (J1.2)
PA0: Schematics_HUMA-mini (U1.10), Peripherals_HUMA-mini (R9.1)
RX: Schematics_HUMA-mini (U1.31), Peripherals_HUMA-mini (J6.3)
SCL: Schematics_HUMA-mini (U1.42), Peripherals_HUMA-mini (U2.2)
SDA: Schematics_HUMA-mini (U1.43), Peripherals_HUMA-mini (U2.3)
SWCLK: Schematics_HUMA-mini (U1.37), Peripherals_HUMA-mini (J1.4)
SWDIO: Schematics_HUMA-mini (U1.34), Peripherals_HUMA-mini (J1.3)
TX: Schematics_HUMA-mini (U1.30), Peripherals_HUMA-mini (J6.2)